# Altium schematic sheet DPPXHK_FMU_PORTS_CAN.SCHDOC
size A4
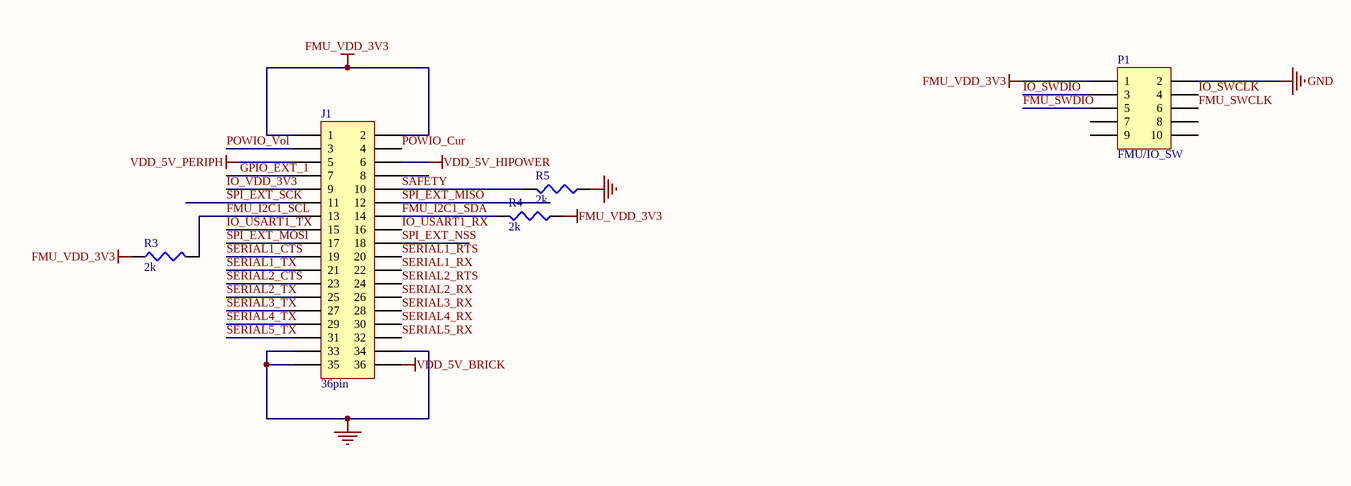
[diagram p0: DPPXHK_FMU_PORTS_CAN.SCHDOC]

## Parts
J1  36pin  [SMD-HEADER-2X20]
P1  FMU/IO_SW  [FPC-0.5-10]
R3  2k  [0402R]
R4  2k  [0402R]
R5  2k  [0402R]

## Nets
FMU_VDD_3V3: J1.1 J1.2 P1.1 R3.1 R4.1
GND: J1.33 J1.34 J1.35 P1.2 R5.1
VDD_5V_BRICK: J1.36
VDD_5V_HIPOWER: J1.6
VDD_5V_PERIPH: J1.5
FMU_I2C1_SCL: J1.13 R3.2
FMU_I2C1_SDA: J1.14 R4.2
FMU_SWCLK: P1.6
FMU_SWDIO: P1.5
GPIO_EXT_1: J1.7
IO_SWCLK: P1.4
IO_SWDIO: P1.3
IO_USART1_RX: J1.16
IO_USART1_TX: J1.15
IO_VDD_3V3: J1.9
POWIO_Cur: J1.4
POWIO_Vol: J1.3
SAFETY: J1.10 R5.2
SERIAL1_CTS: J1.19
SERIAL1_RTS: J1.20
SERIAL1_RX: J1.22
SERIAL1_TX: J1.21
SERIAL2_CTS: J1.23
SERIAL2_RTS: J1.24
SERIAL2_RX: J1.26
SERIAL2_TX: J1.25
SERIAL3_RX: J1.28
SERIAL3_TX: J1.27
SERIAL4_RX: J1.30
SERIAL4_TX: J1.29
SERIAL5_RX: J1.32
SERIAL5_TX: J1.31
SPI_EXT_MISO: J1.12
SPI_EXT_MOSI: J1.17
SPI_EXT_NSS: J1.18
SPI_EXT_SCK: J1.11

Not connected (* = marked no-connect by the designer): J1 8; P1 7 8 9 10

## Library data of the parts
J1 = Header 18X2: Header, 18-Pin, Dual row; LatestRevisionDate: 17-Jul-2002; LatestRevisionNote: Re-released for DXP Platform.; Publisher: Altium Limited
P1 = Header 5X2: Header, 5-Pin, Dual row; LatestRevisionDate: 17-Jul-2002; LatestRevisionNote: Re-released for DXP Platform.; Publisher: Altium Limited
R3-R5 = Res3: Resistor; Published: 8-Jun-2000; LatestRevisionDate: 4-Mar-2005; LatestRevisionNote: PCB Footprint replaced.; Publisher: Altium Limited